# EAGLE schematic ADC_for_Arduino (EAGLE 9.2.2)
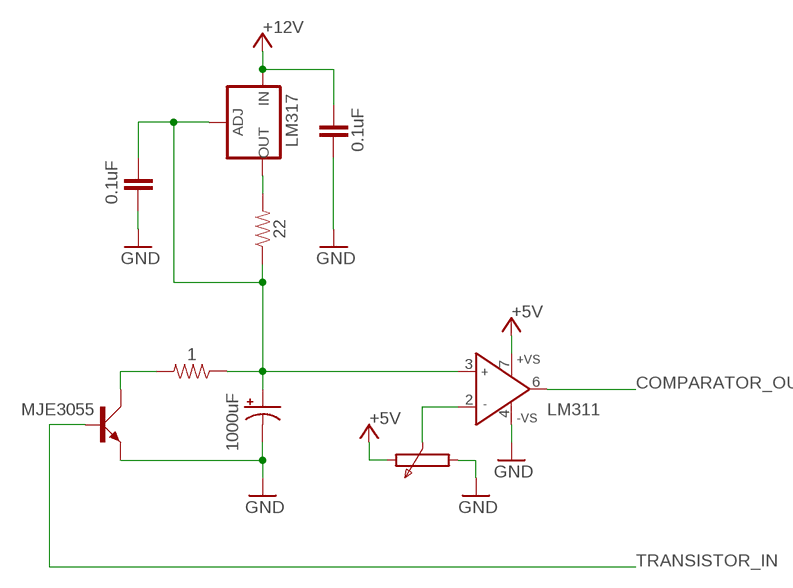
[diagram p0: schematic, sheet 1]

## Parts
C1  1000uF  1000UF-RADIAL-5MM-25V-20%  [CPOL-RADIAL-5MM-10MM]
C2  0.1uF  C-EU025-025X050  [C025-025X050]
C3  C-EU025-025X050  [C025-025X050]
IC1  LM311  AD825R  [SO8]
Q1  MJE3055  [TO220AV]
R1  22  10MOHM-0603-1/10W-5%  [0603]
R2  1  10MOHM-0603-1/10W-5%  [0603]
U1  LM317  V_REG_317SMD  [SOT223]

## Nets
+5V: IC1.7(+VS) ; supply symbol labelled VCC
+12V: C3.1 U1.3(IN)
CAPACITOR_VOL: C1.+ C2.1 IC1.3(IN+) R1.1 R2.1 U1.1(ADJ)
COMPARATOR_OUT: IC1.6(OUT)
GND: C1.- C2.2 C3.2 IC1.4(-VS) Q1.E
N$1: IC1.2(IN-)
N$2: R1.2 U1.2(OUT)
N$3: Q1.C R2.2
TRANSISTOR_IN: Q1.B

## Library data of the parts
C1 = SparkFun-Capacitors:1000UF: 1,000µF/1mF ceramic capacitors A capacitor is a passive two-terminal electrical component used to store electrical energy temporarily in an electric field. CAP-08070; PROD_ID: CAP-09538; VALUE: 1mF
C2 = rcl:C-EU: CAPACITOR, European symbol; SPICEPREFIX: C
C3 = rcl:C-EU: CAPACITOR, European symbol; SPICEPREFIX: 0.1uF
IC1 = analog-devices:AD825: Low Cost, General-Purpose High Speed JFET Amplifier Source: http://www.analog.com/static/imported-files/data_sheets/AD825.pdf; MF: ALTERA CORPORATION; MPN: AD825ARZ; OC_FARNELL: 9603735; OC_NEWARK: 59K6528
Q1 = transistor-power:MJE3055: NPN TRANSISTOR
R1 R2 = SparkFun-Resistors:10MOHM: RES-09327; PROD_ID: RES-08283; VALUE: 10M
U1 = SparkFun-IC-Power:V_REG_317: Voltage Regulator Standard LM317 adjustable voltage regulator. AOI (Adjust Output Input). Google 'LM317 Calculator' for easy to use app to get the two resistor values needed. 240/720 for 5V output. 240/390 for 3.3V output. Spark Fun Electronics SKU : COM-00527